# Altium schematic sheet info.SchDoc: Info
size A4; DocumentNumber: 1; SheetNumber: 1; SheetTotal: 8
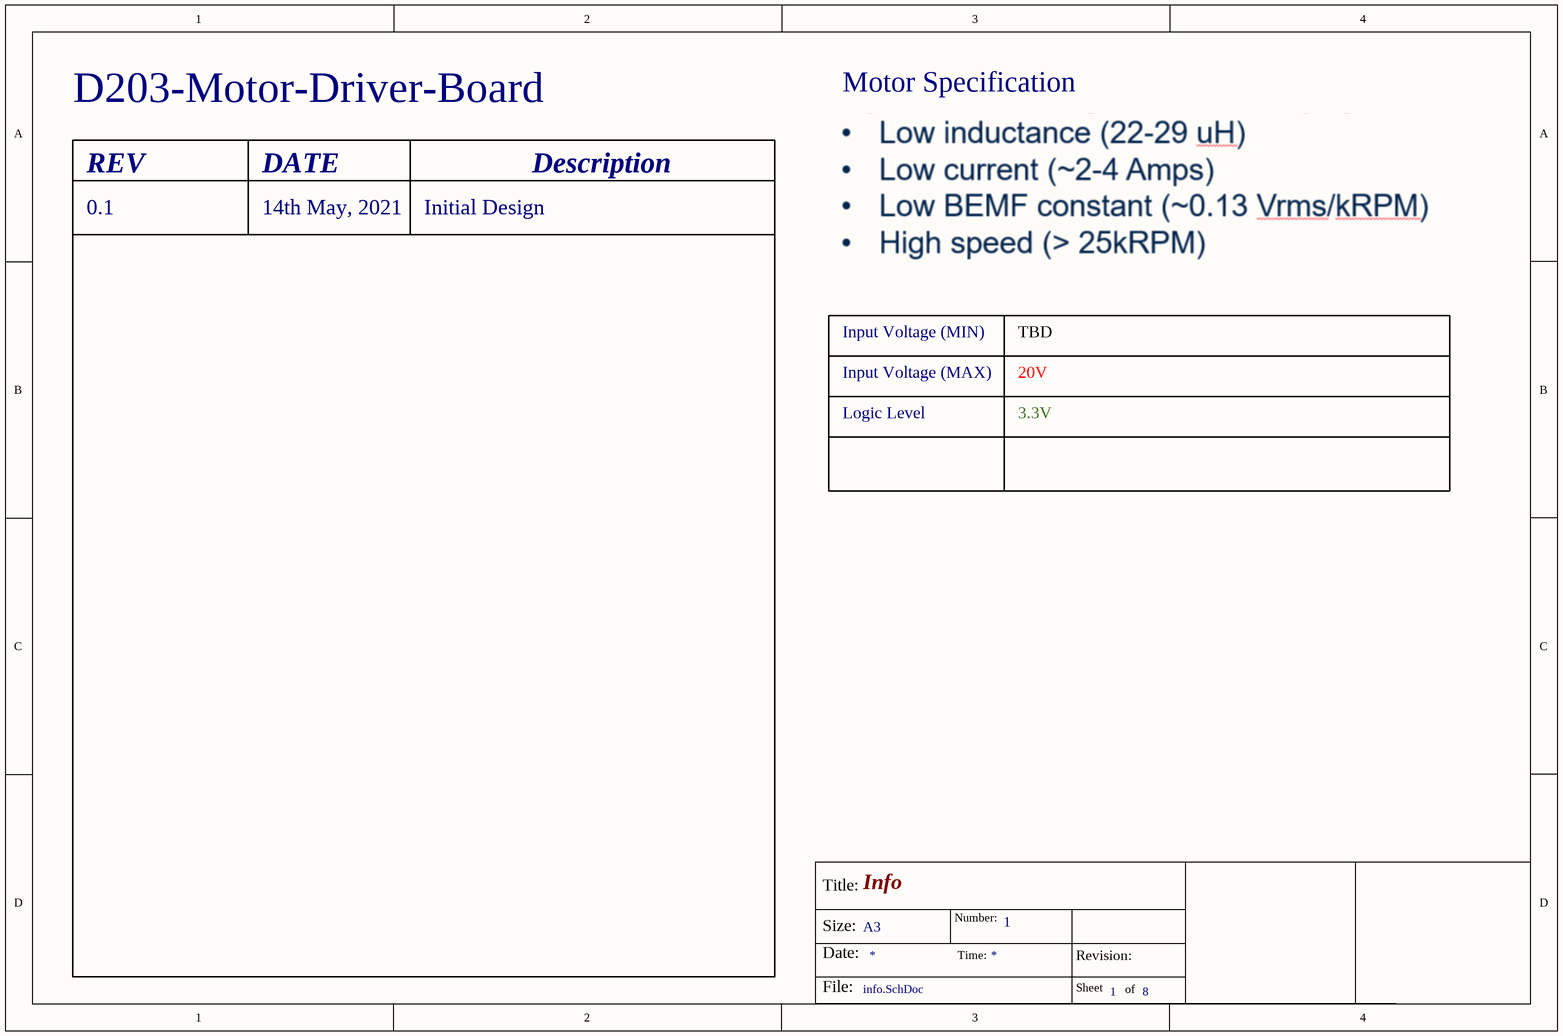
[diagram p0: info.SchDoc]

## Notes on the sheet
- D203-Motor-Driver-Board
- Motor Specification
- REV
- DATE
- Description
- 0.1
- 14th May, 2021
- Initial Design
- Input Voltage (MIN)
- Input Voltage (MAX)
- TBD
- 20V
- Logic Level
- 3.3V
- Title:
- Number:
- Size:
- Date:
- A3
- Time:
- Revision:
- Sheet
- File:
- of